# EAGLE design LCmeter0-LCD-mounted-PIC-COMP (EAGLE 7.6.0)
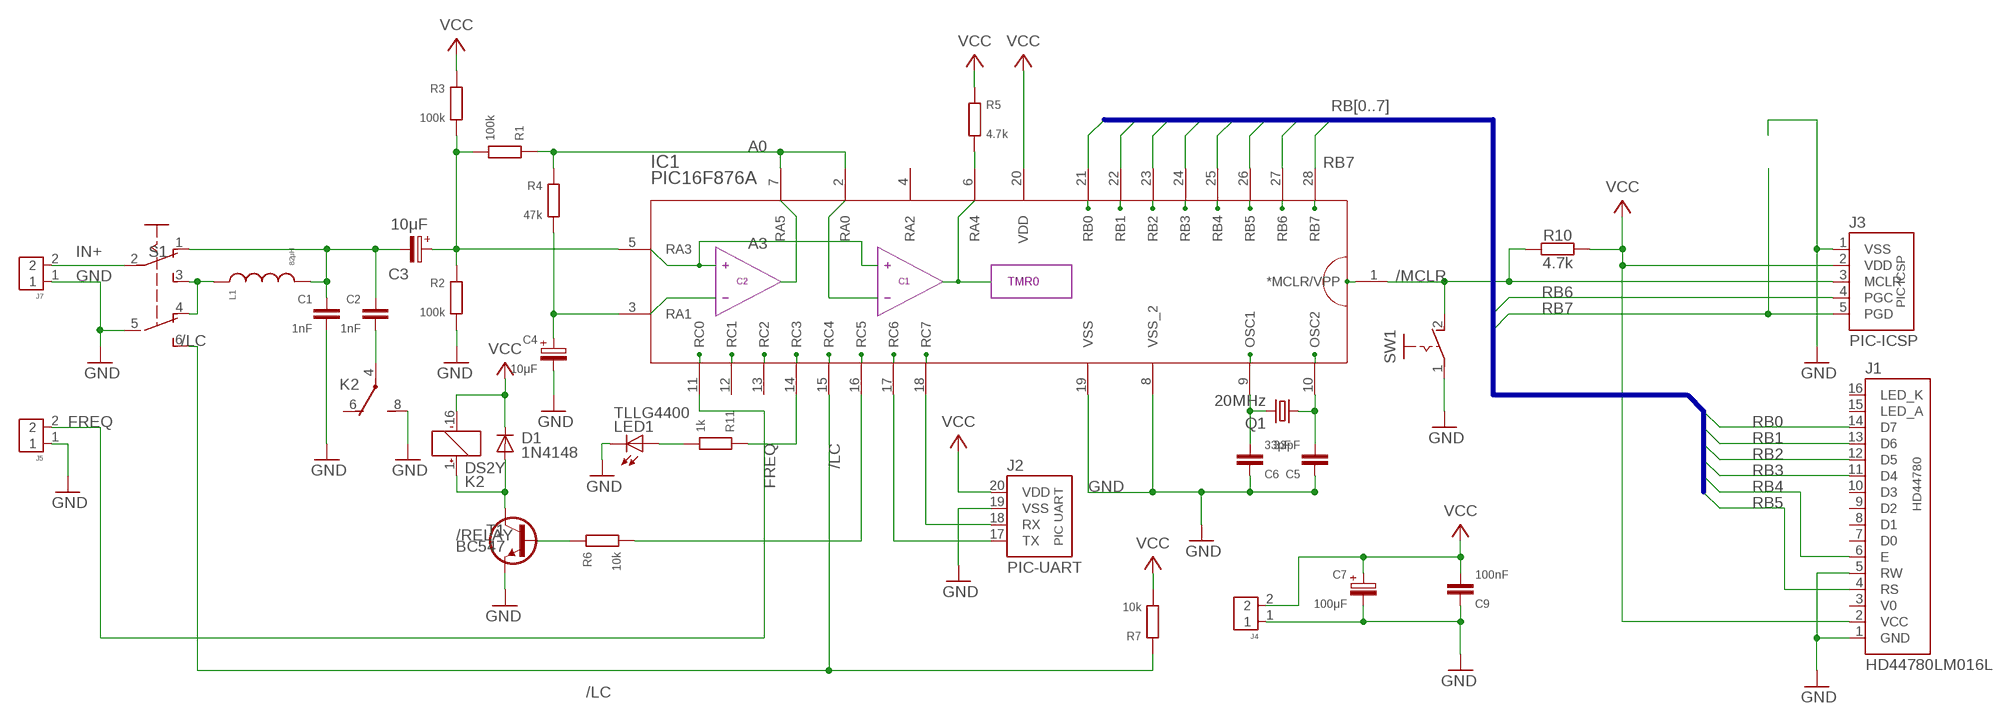
[diagram p0: schematic, sheet 1]

## Parts
C1  1nF  C025-025X060  [C050-025X060]
C2  1nF  C025-025X060  [C050-025X060]
C3  10μF  CPOLE2,5-4  [E2,5-4]
C4  10μF  CPOLE2,5-4  [E2,5-4]
C5  33pF  C025-020X036  [C025-020X036]
C6  33pF  C025-020X036  [C025-020X036]
C7  100μF  CPOLE2.5-5  [E2,5-5]
C9  100nF  C025-020X036/V  [C025-020X036/V]
D1  1N4148  1N414834-7  [DO34-7]
IC1  PIC16F876A  PIC16F876A-X/SP-COMP-B-A  [DIL28-3]
J1  HD44780LM016L  [LM016L-HD44780]
J2  PIC-UART  [PIC-UART]
J3  PIC-ICSP  PIC-ICSPICSP  [PIC-ICSP]
J4  J4  CONN-2P2P/H  [CONN-2P]
J5  CONN-2P2P/V  [CONN-2P-V]
J7  CONN-2P2P/V  [CONN-2P-V]
K2  DS2Y  DS2Y-S-DC5V  [DS2Y]
L1  82μH  LAXIAL  [0207/10]
LED1  TLLG4400  [LED3MM]
Q1  20MHz  CRYSTALHC49  [HC49]
R1  100k  R0202/7  [0202/7]
R2  100k  R0202/7  [0202/7]
R3  100k  R0202/7  [0202/7]
R4  47k  R0202/7  [0202/7]
R5  4.7k  R0202/7  [0202/7]
R6  10k  R0202/10  [0202/10]
R7  10k  R0202/7  [0202/7]
R10  4.7k  R0202/7  [0202/7]
R11  1k  R0202/10-V  [0202/10-V]
S1  SL-SW-2P-2T  [SLSW-2P2T]
SW1  PB-1P-1T  [PB-1P1T]
T1  BC547  BC547CBE  [TO92-CBE]

## Nets
/LC: IC1.15(RC4) R7.2 S1.6(S1)
/MCLR: IC1.1(*MCLR/VPP) J3.3(MCLR) R10.2 SW1.2(S)
/RELAY: D1.A K2.1(1:+) T1.C
A0: IC1.2(RA0) IC1.7(RA5) R1.2 R4.2
A1: C4.+ IC1.3(RA1) R4.1
A3: C3.+ IC1.5(RA3) R1.1 R2.2 R3.1
A4: IC1.6(RA4) R5.1
C2_CON: C2.2 K2.4(2:P)
FREQ: IC1.11(RC0) J5.2
GND: C1.2 C4.- C5.1 C6.1 C7.- C9.1 IC1.8(VSS_2) IC1.19(VSS) J1.1(GND) J1.5(RW) J2.19(VSS) J3.1(VSS) J4.1 J5.1 J7.1 K2.8(2:S) LED1.K(C) R2.1 S1.5(P1) SW1.1(P) T1.E
IN+: J7.2 S1.2(P)
N$1: LED1.A R11.1
N$2: C1.1 C2.1 C3.- L1.2 S1.1(O)
N$5: IC1.14(RC3) R11.2
N$6: R6.2 T1.B
N$7: L1.1 S1.3(S) S1.4(O1)
N$8: IC1.16(RC5) R6.1
N$9: IC1.18(RC7) J2.18(RX)
N$10: IC1.17(RC6) J2.17(TX)
OSC1: C6.2 IC1.9(OSC1) Q1.2
OSC2: C5.2 IC1.10(OSC2) Q1.1
RB0: IC1.21(RB0) J1.14(D7)
RB1: IC1.22(RB1) J1.13(D6)
RB2: IC1.23(RB2) J1.12(D5)
RB3: IC1.24(RB3) J1.11(D4)
RB4: IC1.25(RB4) J1.6(E)
RB5: IC1.26(RB5) J1.4(RS)
RB6: IC1.27(RB6) J3.4(PGC)
RB7: IC1.28(RB7) J3.5(PGD)
VCC: C7.+ C9.2 D1.C IC1.20(VDD) J1.2(VCC) J2.20(VDD) J3.2(VDD) J4.2 K2.16(1:-) R3.2 R5.2 R7.1 R10.1
Unconnected: IC1.4(RA2) IC1.12(RC1) IC1.13(RC2) J1.3(V0) J1.7(D0) J1.8(D1) J1.9(D2) J1.10(D3) J1.15(LED_A) J1.16(LED_K) K2.6(2:O) K2.9(3:S) K2.11(3:O) K2.13(3:P)

## Buses
RB[0..7]

## Library data of the parts
C1 C2 C5 C6 C9 = c:C: CAPACITOR, European symbol
C3 C4 C7 = c:CPOL: POLARIZED CAPACITOR, European symbol
D1 = d:1N4148
IC1 = mcu:PIC16F876A-X/SP-COMP-B-A
J1 = lcd:HD44780
J2 = pinconn:PIC-UART
J3 = pinconn:PIC-ICSP
J4 J5 J7 = pinconn:CONN-2P
K2 = relay:DS2Y-S-DC*: MINIATURE RELAY NAiS Source: http://www.mew-europe.com/.. en_ds_61005_0023.pdf; MPN: DS2Y-S-DC5V; OC_FARNELL: unknown; OC_NEWARK: 13P3268
L1 = r:L
LED1 = led:TLLG4400: Low Current (2mA) LED 3 mm Tinted Diffused Package color GREEN Source: Data sheet <http://www.farnell.com/datasheets/391098.pdf>; MF: VISHAY SEMICONDUCTOR; OC_FARNELL: 1612435
Q1 = q:CRYSTAL
R1-R7 R10 R11 = r:R: RESISTOR, European symbol
S1 = sw:SL-SW-2P-2T
SW1 = sw:PB-1P-1T
T1 = t:BC547

## Net classes
0 default: width 0.61 mm

## Board
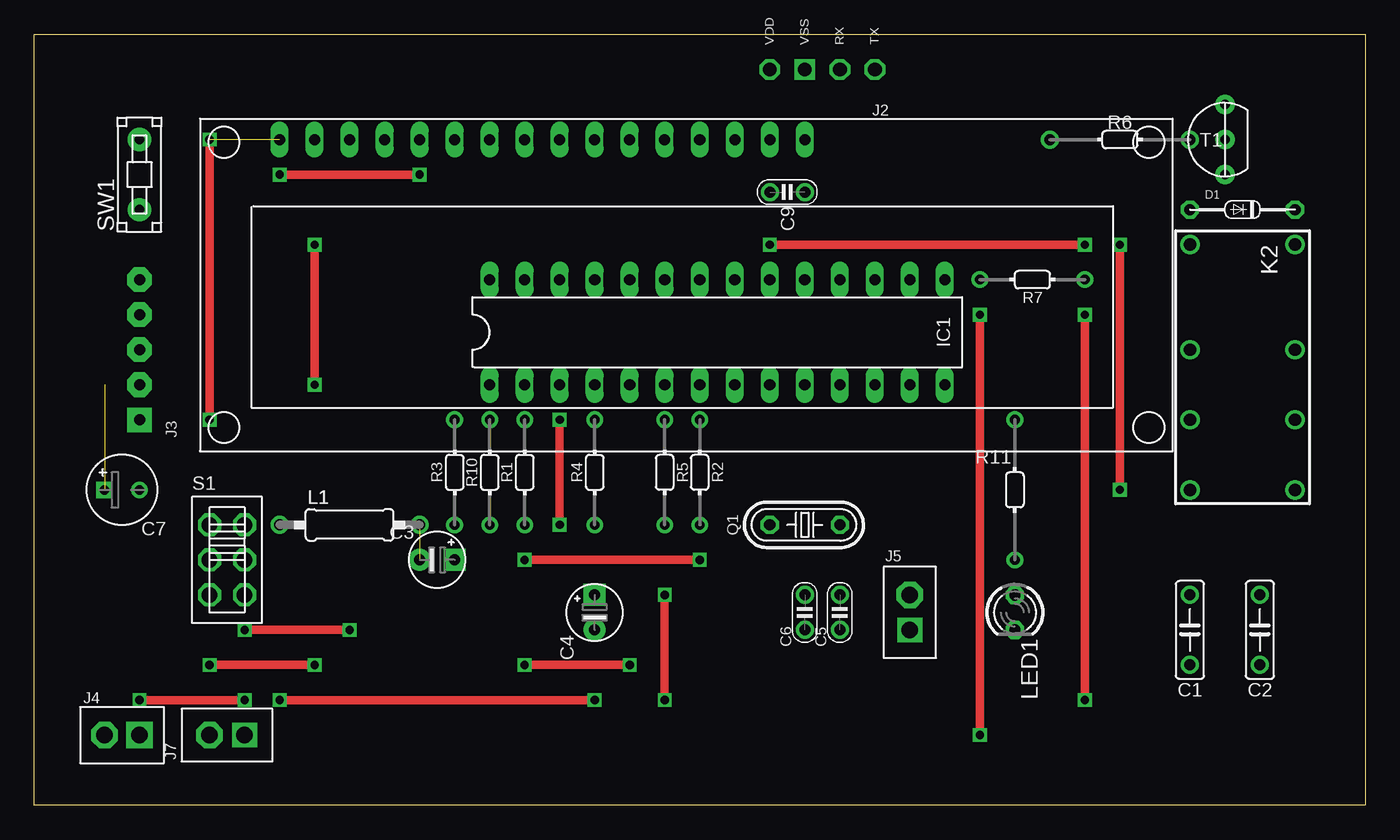
[diagram p1: board, top side]
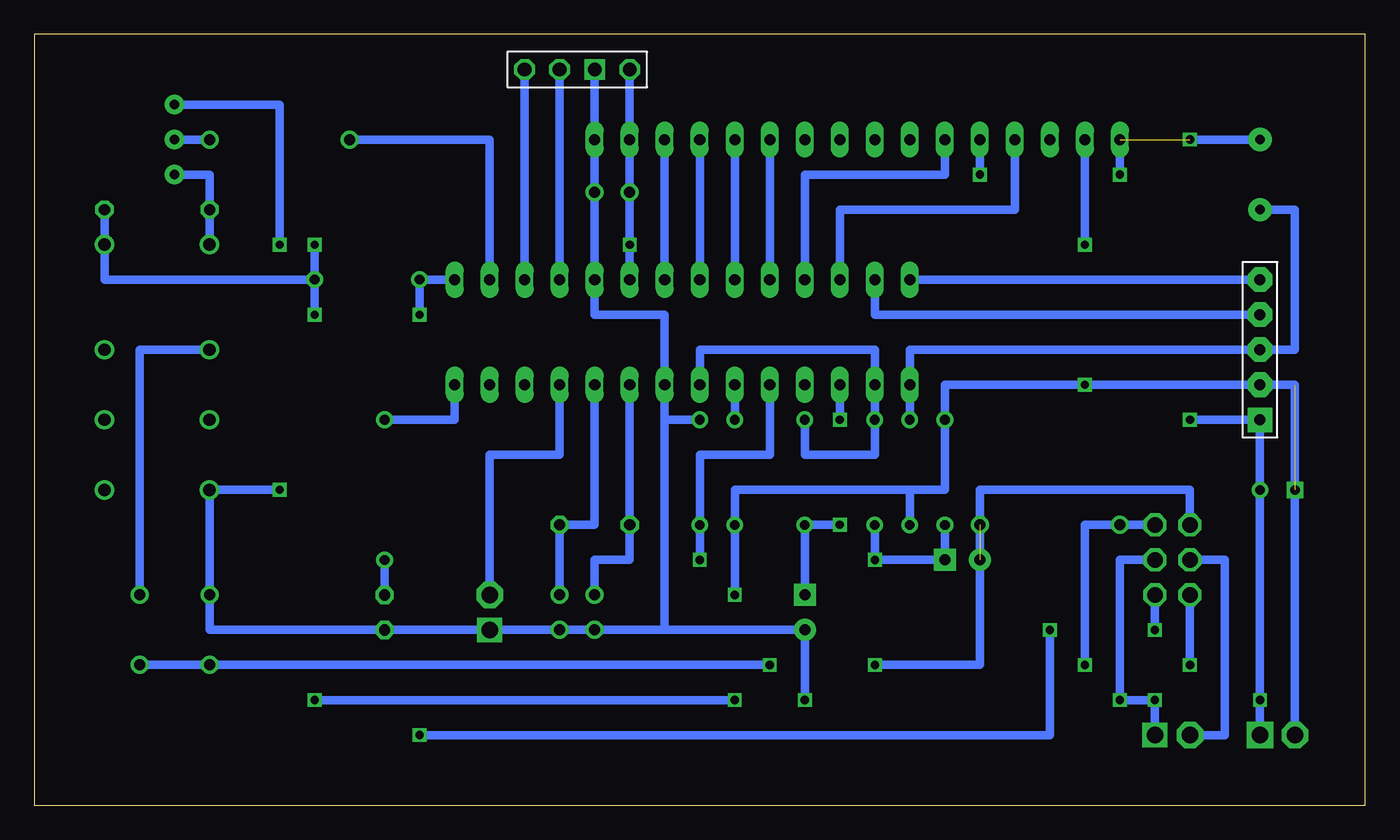
[diagram p2: board, bottom side, seen from below]

Size 96.52 x 55.88 mm. Coordinates in mm from the lower left corner, seen from the top.
Outline: 0,0 0,55.88 96.52,55.88 96.52,0 0,0
Copper layers (1*16): Top 0.035mm / dielectric 1.5mm / Bottom 0.035mm
Design rules "default": minimum track width 10mil, minimum drill 24mil, track to track 8mil, track to pad 8mil, pad to pad 8mil, via to via 8mil, smd to smd 8mil, copper to edge 40mil, drill to drill 8mil, minimum pad ring 10mil, minimum via ring 8mil, stop-mask expansion 4mil, vias tented up to drill 0mil, thermal gap 10mil

### Footprints (pad centres in the part's own frame; a part is rotated, then mirrored left to right if it is on the bottom)
C050-025X060 = drill 0.8: 1 0,2.54; 2 0,-2.54
E2,5-4 = drill 0.8 pad 1.6 square: + 1.27,0 | drill 0.8 pad 1.6: - -1.27,0
C025-020X036 = drill 0.8: 1 0,0; 2 2.54,0
E2,5-5 = drill 0.7 square: + 1.27,0 | drill 0.7: - -1.27,0
C025-020X036/V = drill 0.8: 1 0,-1.27; 2 0,1.27
DO34-7 = drill 0.813 octagon: A 3.81,0; C -3.81,0
DIL28-3 = drill 0.813 long: 1 -16.51,-3.81; 2 -13.97,-3.81; 3 -11.43,-3.81; 4 -8.89,-3.81; 5 -6.35,-3.81; 6 -3.81,-3.81; 7 -1.27,-3.81; 8 1.27,-3.81; 9 3.81,-3.81; 10 6.35,-3.81; 11 8.89,-3.81; 12 11.43,-3.81; 13 13.97,-3.81; 14 16.51,-3.81; 15 16.51,3.81; 16 13.97,3.81; 17 11.43,3.81; 18 8.89,3.81; 19 6.35,3.81; 20 3.81,3.81; 21 1.27,3.81; 22 -1.27,3.81; 23 -3.81,3.81; 24 -6.35,3.81; 25 -8.89,3.81; 26 -11.43,3.81; 27 -13.97,3.81; 28 -16.51,3.81
LM016L-HD44780 = drill 0.8 long: 1 -29.21,11.43; 2 -26.67,11.43; 3 -24.13,11.43; 4 -21.59,11.43; 5 -19.05,11.43; 6 -16.51,11.43; 7 -13.97,11.43; 8 -11.43,11.43; 9 -8.89,11.43; 10 -6.35,11.43; 11 -3.81,11.43; 12 -1.27,11.43; 13 1.27,11.43; 14 3.81,11.43; 15 6.35,11.43; 16 8.89,11.43
PIC-UART = drill 1 octagon: 17 0,0; 18 0,2.54; 20 0,7.62 | drill 1 square: 19 0,5.08
PIC-ICSP = drill 0.8 pad 1.778 square: 1 0,0 | drill 0.8 pad 1.778 octagon: 2 2.54,0; 3 5.08,0; 4 7.62,0; 5 10.16,0
CONN-2P = drill 1.2 pad 1.93 square: 1 0,0 | drill 1.2 pad 1.93 octagon: 2 -2.54,0
CONN-2P-V = drill 1.2 pad 1.778 square: 1 0,0 | drill 1.2 pad 1.93 octagon: 2 0,2.54
DS2Y = drill 0.9: 1 -8.89,-3.81; 4 -1.27,-3.81; 6 3.81,-3.81; 8 8.89,-3.81; 9 8.89,3.81; 11 3.81,3.81; 13 -1.27,3.81; 16 -8.89,3.81
0207/10 = drill 0.8: 1 -5.08,0; 2 5.08,0
LED3MM = drill 0.813 octagon: A -1.27,0; K 1.27,0
HC49 = drill 0.813 octagon: 1 0,-2.54; 2 0,2.54
0202/7 = drill 0.7: 1 -3.81,0; 2 3.81,0
0202/10 = drill 0.8: 1 -5.08,0; 2 5.08,0
0202/10-V = drill 0.7: 1 0,-5.08; 2 0,5.08
SLSW-2P2T = drill 1.118 pad 1.524 octagon: 1 -1.27,2.54; 2 -1.27,0; 3 -1.27,-2.54; 4 1.27,2.54; 5 1.27,0; 6 1.27,-2.54
PB-1P1T = drill 0.7 pad 1.676: 1 2.54,0; 2 -2.54,0
TO92-CBE = drill 0.7 pad 1.422: B 0,0; C 0,2.54; E 0,-2.54

### Placement (x,y rotation side)
C1  83.82,12.7 180 top
C2  88.9,12.7 180 top
C3  29.21,17.78 0 top
C4  40.64,13.97 90 top
C5  58.42,12.7 90 top
C6  55.88,12.7 90 top
C7  6.35,22.86 180 top
C9  54.61,44.45 90 top
D1  87.63,43.18 180 top
IC1  49.53,34.29 0 top
J1  46.99,36.83 0 top
J2  60.96,53.34 90 top
J3  7.62,27.94 90 top
J4  7.62,5.08 0 top
J5  63.5,12.7 0 top
J7  15.24,5.08 90 top
K2  87.63,31.75 270 top
L1  22.86,20.32 0 top
LED1  71.12,13.97 270 top
Q1  55.88,20.32 90 top
R1  35.56,24.13 90 top
R2  48.26,24.13 270 top
R3  30.48,24.13 90 top
R4  40.64,24.13 90 top
R5  45.72,24.13 270 top
R6  78.74,48.26 0 top
R7  72.39,38.1 180 top
R10  33.02,24.13 90 top
R11  71.12,22.86 0 top
S1  13.97,17.78 0 top
SW1  7.62,45.72 90 top
T1  86.36,48.26 180 top

### Tracks (layer width: path | path; a pad name or v marks a point on that pad's centre or on a via)
/LC  (via drill 0.6)
  Top 0.61: v15.24,12.7 v22.86,12.7 | v68.58,5.08 v68.58,35.56
  Bottom 0.61: IC1.15 R7.2 v68.58,35.56 | S1.6 v15.24,12.7 | v22.86,12.7 22.86,5.08 v68.58,5.08
/MCLR
  Bottom 0.61: SW1.2 5.08,43.18 5.08,33.02 J3.3 33.02,33.02 IC1.1 R10.2
/RELAY
  Bottom 0.61: T1.C 83.82,45.72 D1.A K2.1
A0
  Bottom 0.61: R4.2 40.64,25.4 35.56,25.4 R1.2 IC1.2 35.56,33.02 48.26,33.02 IC1.7
A1  (via drill 0.6)
  Top 0.61: v38.1,27.94 v38.1,20.32
  Bottom 0.61: IC1.3 v38.1,27.94 | v38.1,20.32 R4.1 C4.+
A3  (via drill 0.6)
  Top 0.61: v35.56,17.78 v48.26,17.78
  Bottom 0.61: R3.1 C3.+ v35.56,17.78 R1.1 | v48.26,17.78 R2.2 48.26,25.4 43.18,25.4 IC1.5
A4
  Bottom 0.61: R5.1 IC1.6
C2_CON
  Bottom 0.61: C2.2 88.9,33.02 K2.4
FREQ
  Bottom 0.61: IC1.11 58.42,25.4 63.5,25.4 J5.2
GND  (via drill 0.6)  (1 unrouted)
  Top 0.61: v40.64,7.62 v17.78,7.62 | v7.62,7.62 v15.24,7.62 | v12.7,27.94 v12.7,48.26 | v78.74,40.64 v78.74,22.86 | v27.94,45.72 v17.78,45.72
  Bottom 0.61: R2.1 50.8,27.94 | 50.8,12.7 C4.- v40.64,7.62 | S1.5 17.78,17.78 v17.78,7.62 v15.24,7.62 J7.1 | LED1.K J5.1 | J5.1 83.82,12.7 C1.2 K2.8 v78.74,22.86 | v12.7,27.94 J3.1 C7.- v7.62,7.62 J4.1 | SW1.1 v12.7,48.26 | T1.E 78.74,50.8 v78.74,40.64 | J1.5 v27.94,45.72 | v17.78,45.72 J1.1 | C6.1 C5.1 | 50.8,27.94 IC1.8 50.8,35.56 55.88,35.56 IC1.19 C9.1 J2.19 | 50.8,27.94 50.8,12.7 | 50.8,12.7 C5.1 | J5.1 C5.1
IN+
  Bottom 0.61: J7.2 10.16,5.08 10.16,17.78 S1.2
N$1
  Bottom 0.61: LED1.A R11.1
N$2  (via drill 0.6)  (1 unrouted)
  Top 0.61: v35.56,10.16 v43.18,10.16
  Bottom 0.61: S1.1 12.7,22.86 27.94,22.86 L1.2 27.94,10.16 v35.56,10.16 | v43.18,10.16 C1.1 C2.1
N$5
  Bottom 0.61: R11.2 66.04,27.94 IC1.14
N$6
  Bottom 0.61: T1.B R6.2
N$7  (via drill 0.6)
  Top 0.61: v12.7,10.16 v20.32,10.16
  Bottom 0.61: S1.4 L1.1 20.32,20.32 v20.32,10.16 | S1.3 v12.7,10.16
N$8
  Bottom 0.61: R6.1 63.5,48.26 IC1.16
N$9
  Bottom 0.61: IC1.18 J2.18
N$10
  Bottom 0.61: IC1.17 J2.17
OSC1
  Bottom 0.61: C6.2 55.88,17.78 53.34,17.78 Q1.2 IC1.9
OSC2
  Bottom 0.61: C5.2 Q1.1 55.88,20.32 IC1.10
RB0
  Bottom 0.61: J1.14 IC1.21
RB1
  Bottom 0.61: IC1.22 J1.13
RB2
  Bottom 0.61: J1.12 IC1.23
RB3
  Bottom 0.61: IC1.24 J1.11
RB4
  Bottom 0.61: IC1.25 40.64,45.72 30.48,45.72 J1.6
RB5
  Bottom 0.61: IC1.26 38.1,43.18 25.4,43.18 J1.4
RB6
  Bottom 0.61: J3.4 35.56,35.56 IC1.27
RB7
  Bottom 0.61: J3.5 IC1.28
VCC  (via drill 0.6)  (1 unrouted)
  Top 0.61: v53.34,40.64 v76.2,40.64 | v45.72,15.24 v45.72,7.62 | v76.2,7.62 v76.2,35.56 | v20.32,40.64 v20.32,30.48
  Bottom 0.61: IC1.20 v53.34,40.64 C9.2 | v76.2,40.64 R7.1 | v76.2,35.56 R7.1 | R7.1 91.44,38.1 K2.16 D1.C | J2.20 C9.2 | C9.2 53.34,41.91 | 33.02,22.86 30.48,22.86 R3.2 30.48,30.48 v20.32,30.48 J3.2 5.08,30.48 J4.2 | R10.1 33.02,22.86 | 33.02,22.86 45.72,22.86 R5.2 v45.72,15.24 | v45.72,7.62 v76.2,7.62 | J1.2 v20.32,40.64